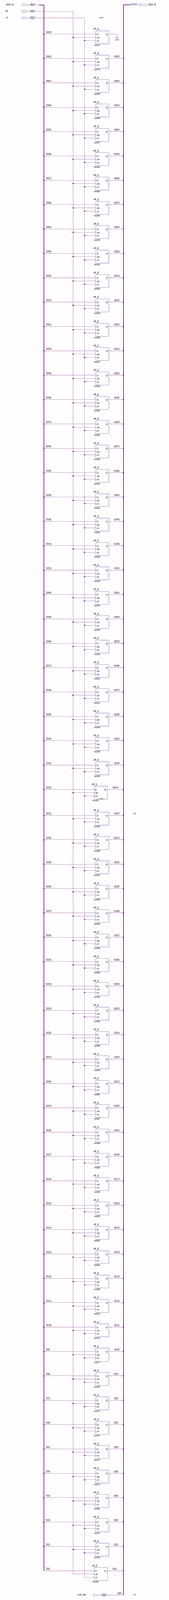
[diagram p0: schematic sheet, whole]
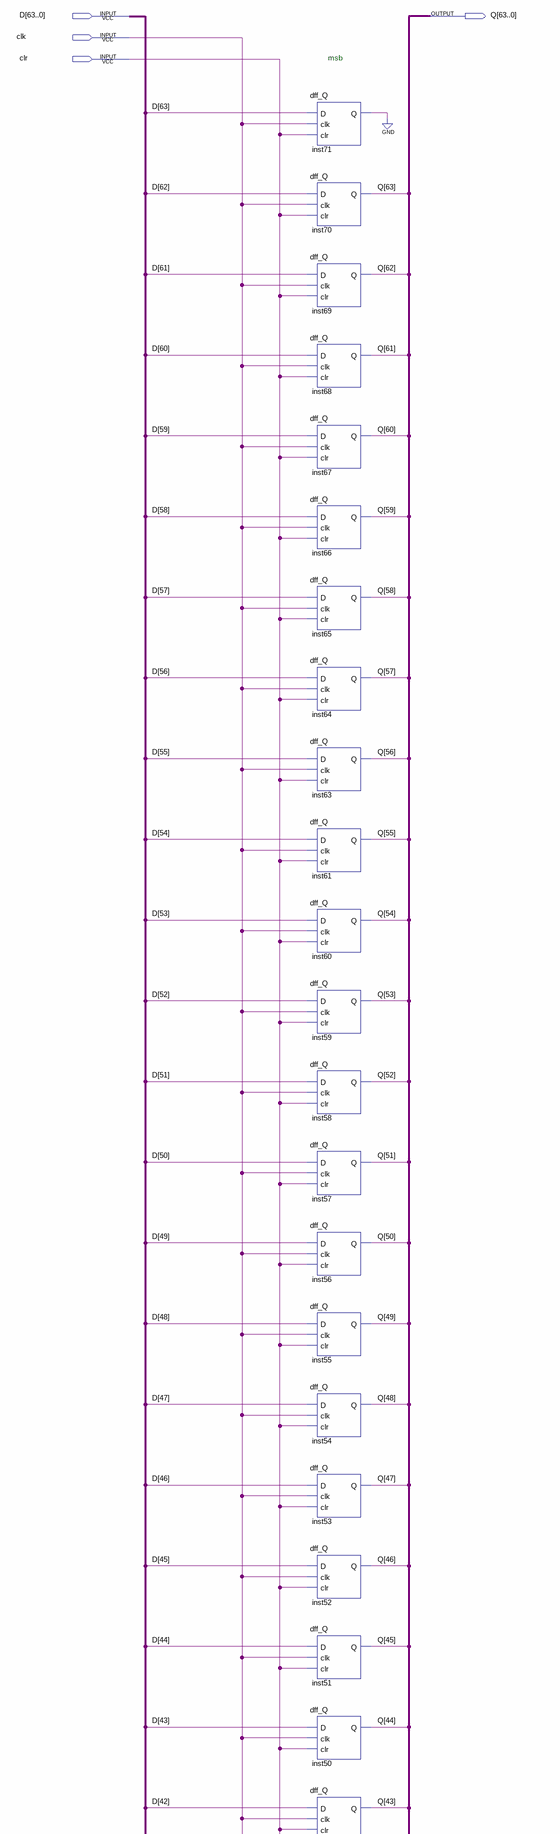
[diagram p1: schematic sheet, upper part]
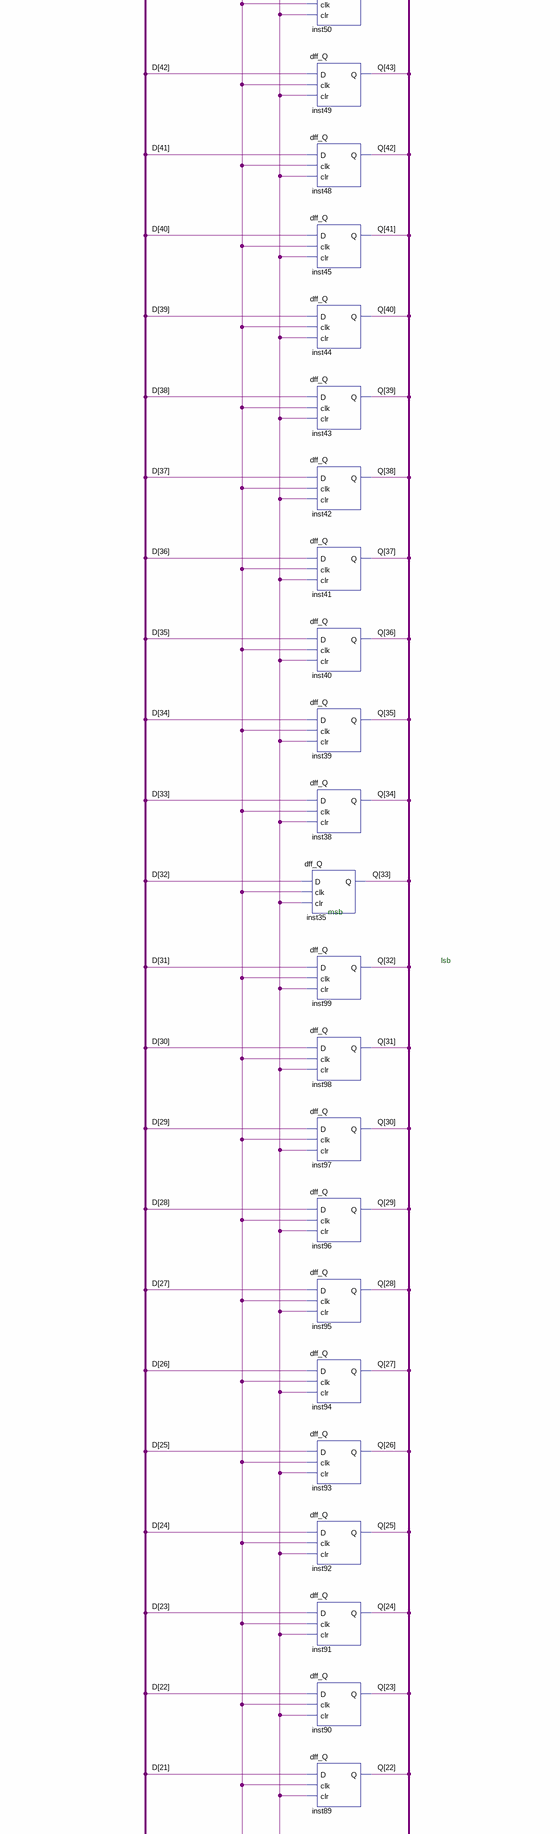
[diagram p2: schematic sheet, middle part]
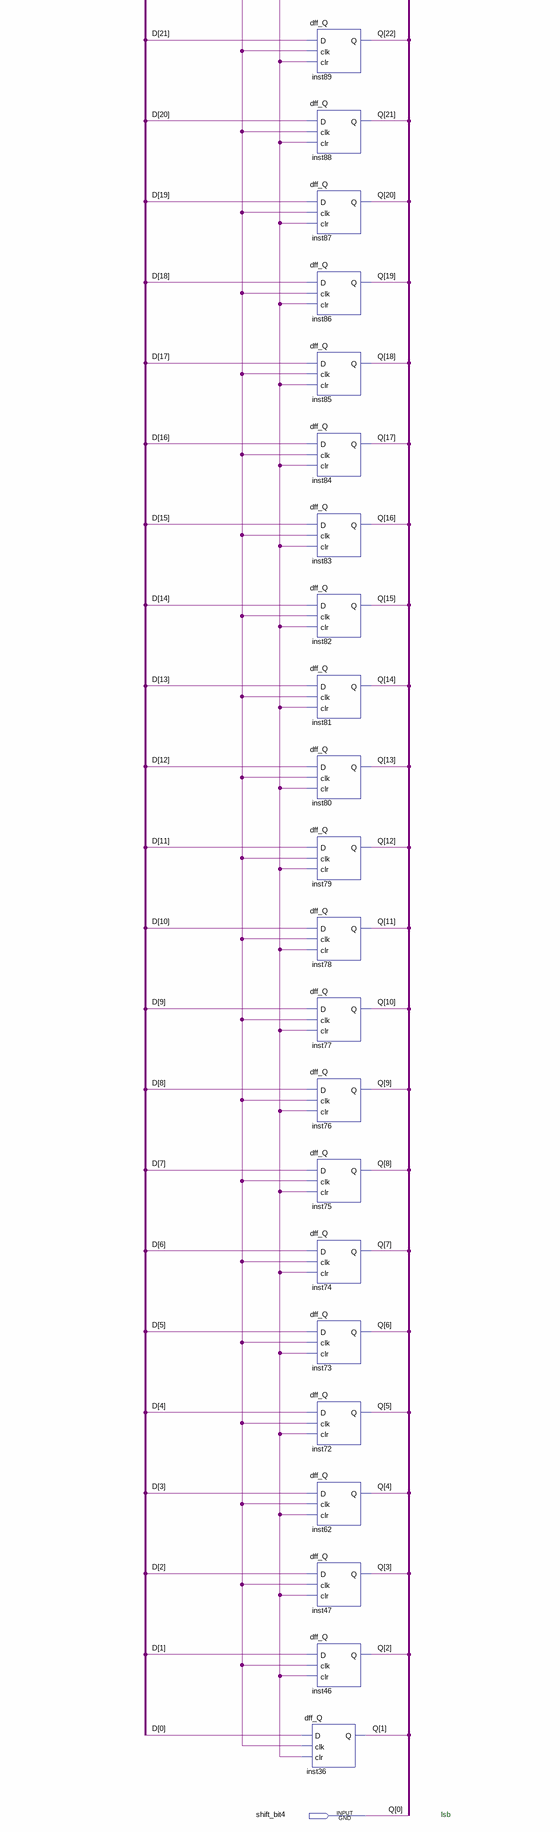
[diagram p3: schematic sheet, lower part]
// Quartus schematic left_shift_64.bdf as structural Verilog: 64 symbols, 5 pins
module left_shift_64 (
  input  [63:0] D,
  input  clk,
  input  clr,
  input  shift_bit4,
  output [63:0] Q
);

  wire inst71_q;

  dff_Q inst71 (.D(D[63]), .clk(clk), .clr(clr), .Q(inst71_q));
  dff_Q inst70 (.D(D[62]), .clk(clk), .clr(clr), .Q(Q[63]));
  dff_Q inst69 (.D(D[61]), .clk(clk), .clr(clr), .Q(Q[62]));
  dff_Q inst68 (.D(D[60]), .clk(clk), .clr(clr), .Q(Q[61]));
  dff_Q inst67 (.D(D[59]), .clk(clk), .clr(clr), .Q(Q[60]));
  dff_Q inst66 (.D(D[58]), .clk(clk), .clr(clr), .Q(Q[59]));
  dff_Q inst65 (.D(D[57]), .clk(clk), .clr(clr), .Q(Q[58]));
  dff_Q inst64 (.D(D[56]), .clk(clk), .clr(clr), .Q(Q[57]));
  dff_Q inst63 (.D(D[55]), .clk(clk), .clr(clr), .Q(Q[56]));
  dff_Q inst61 (.D(D[54]), .clk(clk), .clr(clr), .Q(Q[55]));
  dff_Q inst60 (.D(D[53]), .clk(clk), .clr(clr), .Q(Q[54]));
  dff_Q inst59 (.D(D[52]), .clk(clk), .clr(clr), .Q(Q[53]));
  dff_Q inst58 (.D(D[51]), .clk(clk), .clr(clr), .Q(Q[52]));
  dff_Q inst57 (.D(D[50]), .clk(clk), .clr(clr), .Q(Q[51]));
  dff_Q inst56 (.D(D[49]), .clk(clk), .clr(clr), .Q(Q[50]));
  dff_Q inst55 (.D(D[48]), .clk(clk), .clr(clr), .Q(Q[49]));
  dff_Q inst54 (.D(D[47]), .clk(clk), .clr(clr), .Q(Q[48]));
  dff_Q inst53 (.D(D[46]), .clk(clk), .clr(clr), .Q(Q[47]));
  dff_Q inst52 (.D(D[45]), .clk(clk), .clr(clr), .Q(Q[46]));
  dff_Q inst51 (.D(D[44]), .clk(clk), .clr(clr), .Q(Q[45]));
  dff_Q inst50 (.D(D[43]), .clk(clk), .clr(clr), .Q(Q[44]));
  dff_Q inst49 (.D(D[42]), .clk(clk), .clr(clr), .Q(Q[43]));
  dff_Q inst48 (.D(D[41]), .clk(clk), .clr(clr), .Q(Q[42]));
  dff_Q inst45 (.D(D[40]), .clk(clk), .clr(clr), .Q(Q[41]));
  dff_Q inst44 (.D(D[39]), .clk(clk), .clr(clr), .Q(Q[40]));
  dff_Q inst43 (.D(D[38]), .clk(clk), .clr(clr), .Q(Q[39]));
  dff_Q inst42 (.D(D[37]), .clk(clk), .clr(clr), .Q(Q[38]));
  dff_Q inst41 (.D(D[36]), .clk(clk), .clr(clr), .Q(Q[37]));
  dff_Q inst40 (.D(D[35]), .clk(clk), .clr(clr), .Q(Q[36]));
  dff_Q inst39 (.D(D[34]), .clk(clk), .clr(clr), .Q(Q[35]));
  dff_Q inst38 (.D(D[33]), .clk(clk), .clr(clr), .Q(Q[34]));
  dff_Q inst35 (.D(D[32]), .clk(clk), .clr(clr), .Q(Q[33]));
  dff_Q inst99 (.D(D[31]), .clk(clk), .clr(clr), .Q(Q[32]));
  dff_Q inst98 (.D(D[30]), .clk(clk), .clr(clr), .Q(Q[31]));
  dff_Q inst97 (.D(D[29]), .clk(clk), .clr(clr), .Q(Q[30]));
  dff_Q inst96 (.D(D[28]), .clk(clk), .clr(clr), .Q(Q[29]));
  dff_Q inst95 (.D(D[27]), .clk(clk), .clr(clr), .Q(Q[28]));
  dff_Q inst94 (.D(D[26]), .clk(clk), .clr(clr), .Q(Q[27]));
  dff_Q inst93 (.D(D[25]), .clk(clk), .clr(clr), .Q(Q[26]));
  dff_Q inst92 (.D(D[24]), .clk(clk), .clr(clr), .Q(Q[25]));
  dff_Q inst91 (.D(D[23]), .clk(clk), .clr(clr), .Q(Q[24]));
  dff_Q inst90 (.D(D[22]), .clk(clk), .clr(clr), .Q(Q[23]));
  dff_Q inst89 (.D(D[21]), .clk(clk), .clr(clr), .Q(Q[22]));
  dff_Q inst88 (.D(D[20]), .clk(clk), .clr(clr), .Q(Q[21]));
  dff_Q inst87 (.D(D[19]), .clk(clk), .clr(clr), .Q(Q[20]));
  dff_Q inst86 (.D(D[18]), .clk(clk), .clr(clr), .Q(Q[19]));
  dff_Q inst85 (.D(D[17]), .clk(clk), .clr(clr), .Q(Q[18]));
  dff_Q inst84 (.D(D[16]), .clk(clk), .clr(clr), .Q(Q[17]));
  dff_Q inst83 (.D(D[15]), .clk(clk), .clr(clr), .Q(Q[16]));
  dff_Q inst82 (.D(D[14]), .clk(clk), .clr(clr), .Q(Q[15]));
  dff_Q inst81 (.D(D[13]), .clk(clk), .clr(clr), .Q(Q[14]));
  dff_Q inst80 (.D(D[12]), .clk(clk), .clr(clr), .Q(Q[13]));
  dff_Q inst79 (.D(D[11]), .clk(clk), .clr(clr), .Q(Q[12]));
  dff_Q inst78 (.D(D[10]), .clk(clk), .clr(clr), .Q(Q[11]));
  dff_Q inst77 (.D(D[9]), .clk(clk), .clr(clr), .Q(Q[10]));
  dff_Q inst76 (.D(D[8]), .clk(clk), .clr(clr), .Q(Q[9]));
  dff_Q inst75 (.D(D[7]), .clk(clk), .clr(clr), .Q(Q[8]));
  dff_Q inst74 (.D(D[6]), .clk(clk), .clr(clr), .Q(Q[7]));
  dff_Q inst73 (.D(D[5]), .clk(clk), .clr(clr), .Q(Q[6]));
  dff_Q inst72 (.D(D[4]), .clk(clk), .clr(clr), .Q(Q[5]));
  dff_Q inst62 (.D(D[3]), .clk(clk), .clr(clr), .Q(Q[4]));
  dff_Q inst47 (.D(D[2]), .clk(clk), .clr(clr), .Q(Q[3]));
  dff_Q inst46 (.D(D[1]), .clk(clk), .clr(clr), .Q(Q[2]));
  dff_Q inst36 (.D(D[0]), .clk(clk), .clr(clr), .Q(Q[1]));

  assign Q[0] = shift_bit4;
  // also tied to GND on the sheet: inst71_q

  // Notes on the sheet:
  //   msb
  //   msb
  //   lsb
  //   lsb
endmodule
